# EAGLE design Tarjeta5_NOOUTLINE (EAGLE 7.6.0)
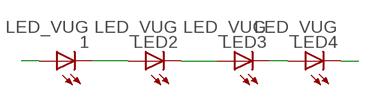
[diagram p0: schematic, sheet 1]

## Parts
1  LED_VUG  [CINVESTAV_LUXEON]
LED2  LED_VUG  [CINVESTAV_LUXEON]
LED3  LED_VUG  [CINVESTAV_LUXEON]
LED4  LED_VUG  [CINVESTAV_LUXEON]

## Nets
GROUND: LED4.C
N$5: 1.C LED2.A
N$6: LED2.C LED3.A
N$7: LED3.C LED4.A
POWER: 1.A

## Library data of the parts
1 LED2-LED4 = led_lumiled:LED_VUG: LED_VUG

## Board
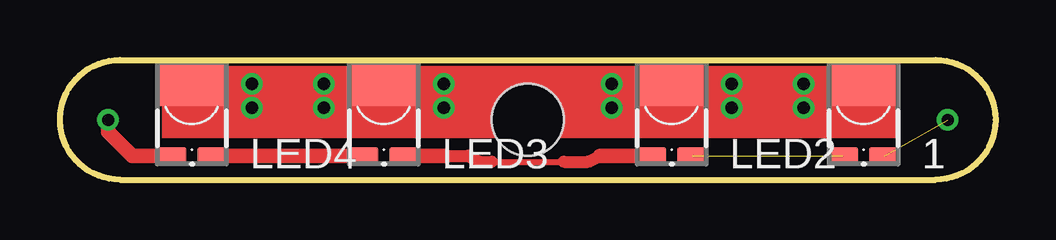
[diagram p1: board, top side]
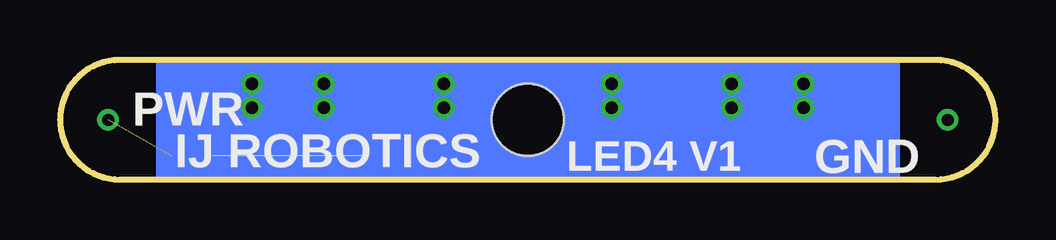
[diagram p2: board, bottom side, seen from below]

Size 39 x 5 mm. Coordinates in mm from the lower left corner, seen from the top.
Outline: 2.5,5 36.5,5 arc-90 39,2.5 arc-90 36.5,0 2.5,0 arc-90 0,2.5 arc-90 2.5,5
Copper layers (1*16): Top 0.035mm / dielectric 0.204mm / Bottom 0.035mm
Design rules "default *": minimum track width 10mil, minimum drill 24mil, track to track 8mil, track to pad 8mil, pad to pad 8mil, via to via 8mil, smd to smd 8mil, copper to edge 40mil, drill to drill 8mil, minimum pad ring 10mil, minimum via ring 8mil, stop-mask expansion 4mil, vias tented up to drill 0mil, thermal gap 10mil
Holes 3 mm at 19.5,2.5

### Footprints (pad centres in the part's own frame; a part is rotated, then mirrored left to right if it is on the bottom)
CINVESTAV_LUXEON = smd 1.26 x 0.73: A 0.87,-2.51; C -0.87,-2.51 | smd 2.86 x 1.83: TH 0.01,0.49

### Placement (x,y rotation side)
1  33.5,3.5 0 top
LED2  25.5,3.5 0 top
LED3  13.5,3.5 0 top
LED4  5.5,3.5 0 top

### Tracks (layer width: path | path; a pad name or v marks a point on that pad's centre or on a via)
GROUND  (via drill 0.5 pad 0.36)
  Top 0.61: v2,2.5 2,2 3,1 LED4.C
N$4  (via drill 0.51)
  other vias: 8,3
N$5  (1 unrouted)
N$6
  Top 0.25: 18,0.75 21,0.75
  Top 0.5: 16,1 17,1 17.5,0.75 18,0.75 | 21,0.75 22,0.75 22.5,1
  Top 0.61: LED3.A 15.99,0.99 16,1 | 22.5,1 LED2.C
N$7
  Top 0.61: LED4.A 11.99,0.99 12,1 LED3.C
N$8  (via drill 0.51)
  other vias: 8,4
N$9  (via drill 0.51)
  other vias: 11,4
N$10  (via drill 0.51)
  other vias: 11,3
N$11  (via drill 0.51)
  other vias: 16,3
N$12  (via drill 0.51)
  other vias: 16,4
N$13  (via drill 0.51)
  other vias: 23,4
N$14  (via drill 0.51)
  other vias: 23,3
N$15  (via drill 0.51)
  other vias: 28,3
N$16  (via drill 0.51)
  other vias: 28,4
N$17  (via drill 0.51)
  other vias: 31,4
N$18  (via drill 0.51)
  other vias: 31,3
POWER  (via drill 0.5 pad 0.64)  (1 unrouted)
  other vias: 37,2.5
(copper drawn outside any net)
  shapes: Bottom area x2, Top area x2

### Text on the board
bNames: PWR | GND | IJ ROBOTICS | LED4 V1